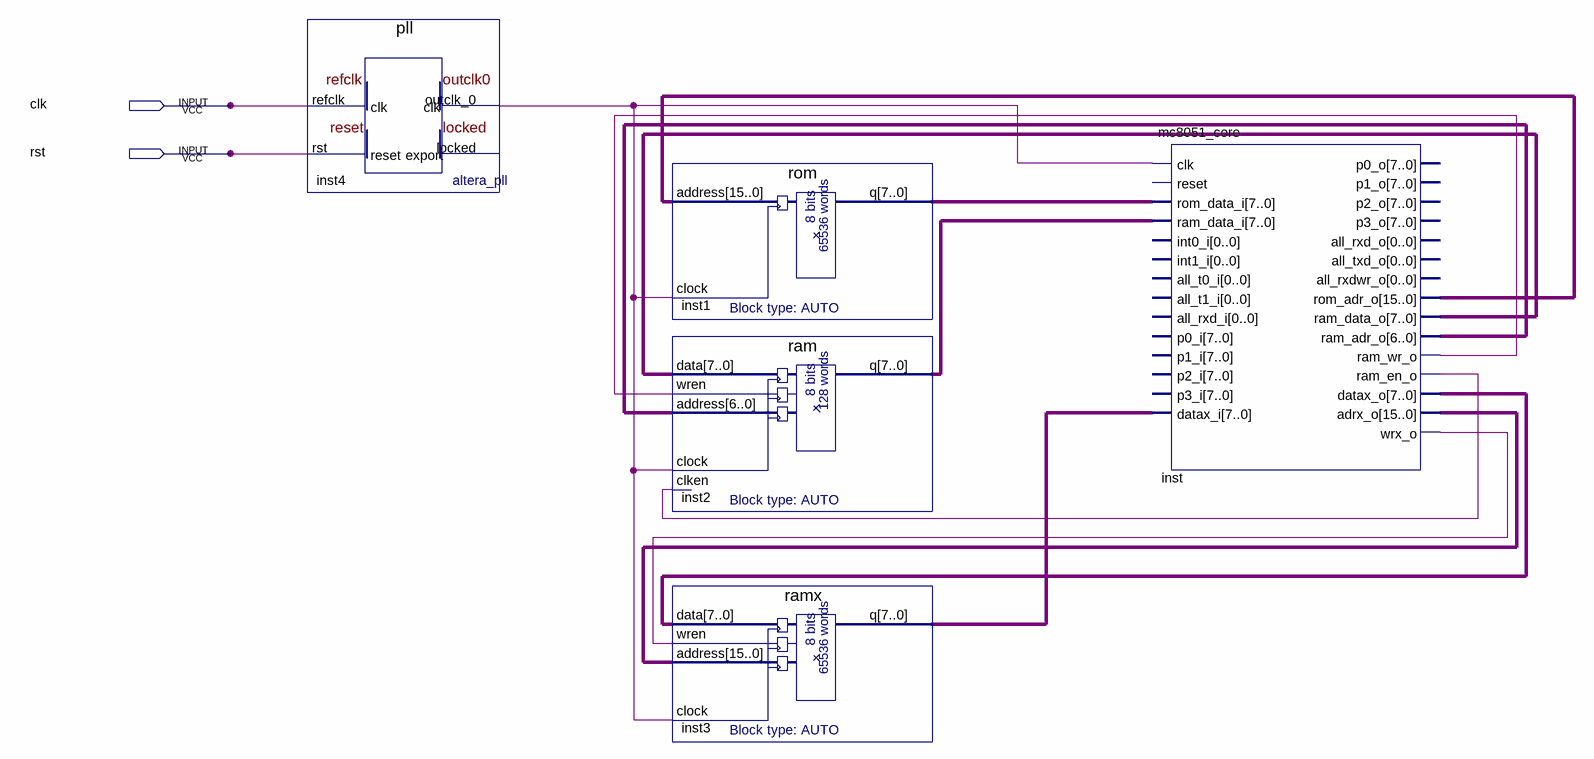
[diagram p0: schematic sheet]
// Quartus schematic 51core.bdf as structural Verilog: 5 symbols, 2 pins
module \51core  (
  input  clk,
  input  rst
);

  wire inst4_outclk_0, inst_ram_en_o, inst_ram_wr_o, inst_wrx_o;
  wire [6:0] inst_ram_adr_o;
  wire [7:0] inst1_q, inst2_q, inst3_q, inst_datax_o, inst_ram_data_o;
  wire [15:0] inst_adrx_o, inst_rom_adr_o;

  pll inst4 (.refclk(clk), .rst(rst), .outclk_0(inst4_outclk_0));  // open: locked
  rom inst1 (.address(inst_rom_adr_o), .clock(inst4_outclk_0), .q(inst1_q));
  ram inst2 (
    .data(inst_ram_data_o), .wren(inst_ram_wr_o), .address(inst_ram_adr_o), .clock(inst4_outclk_0),
    .clken(inst_ram_en_o), .q(inst2_q));
  ramx inst3 (.data(inst_datax_o), .wren(inst_wrx_o), .address(inst_adrx_o), .clock(inst4_outclk_0), .q(inst3_q));
  mc8051_core inst (
    .clk(inst4_outclk_0), .rom_data_i(inst1_q), .ram_data_i(inst2_q), .datax_i(inst3_q),
    .rom_adr_o(inst_rom_adr_o), .ram_data_o(inst_ram_data_o), .ram_adr_o(inst_ram_adr_o),
    .ram_wr_o(inst_ram_wr_o), .ram_en_o(inst_ram_en_o), .datax_o(inst_datax_o), .adrx_o(inst_adrx_o),
    .wrx_o(inst_wrx_o));  // open: reset, int0_i, int1_i, all_t0_i, all_t1_i, all_rxd_i, p0_i, p1_i, p2_i, p3_i, p0_o, p1_o, p2_o, p3_o, all_rxd_o, all_txd_o, all_rxdwr_o
endmodule
